# Altium project GCMPlaca.PrjPcb
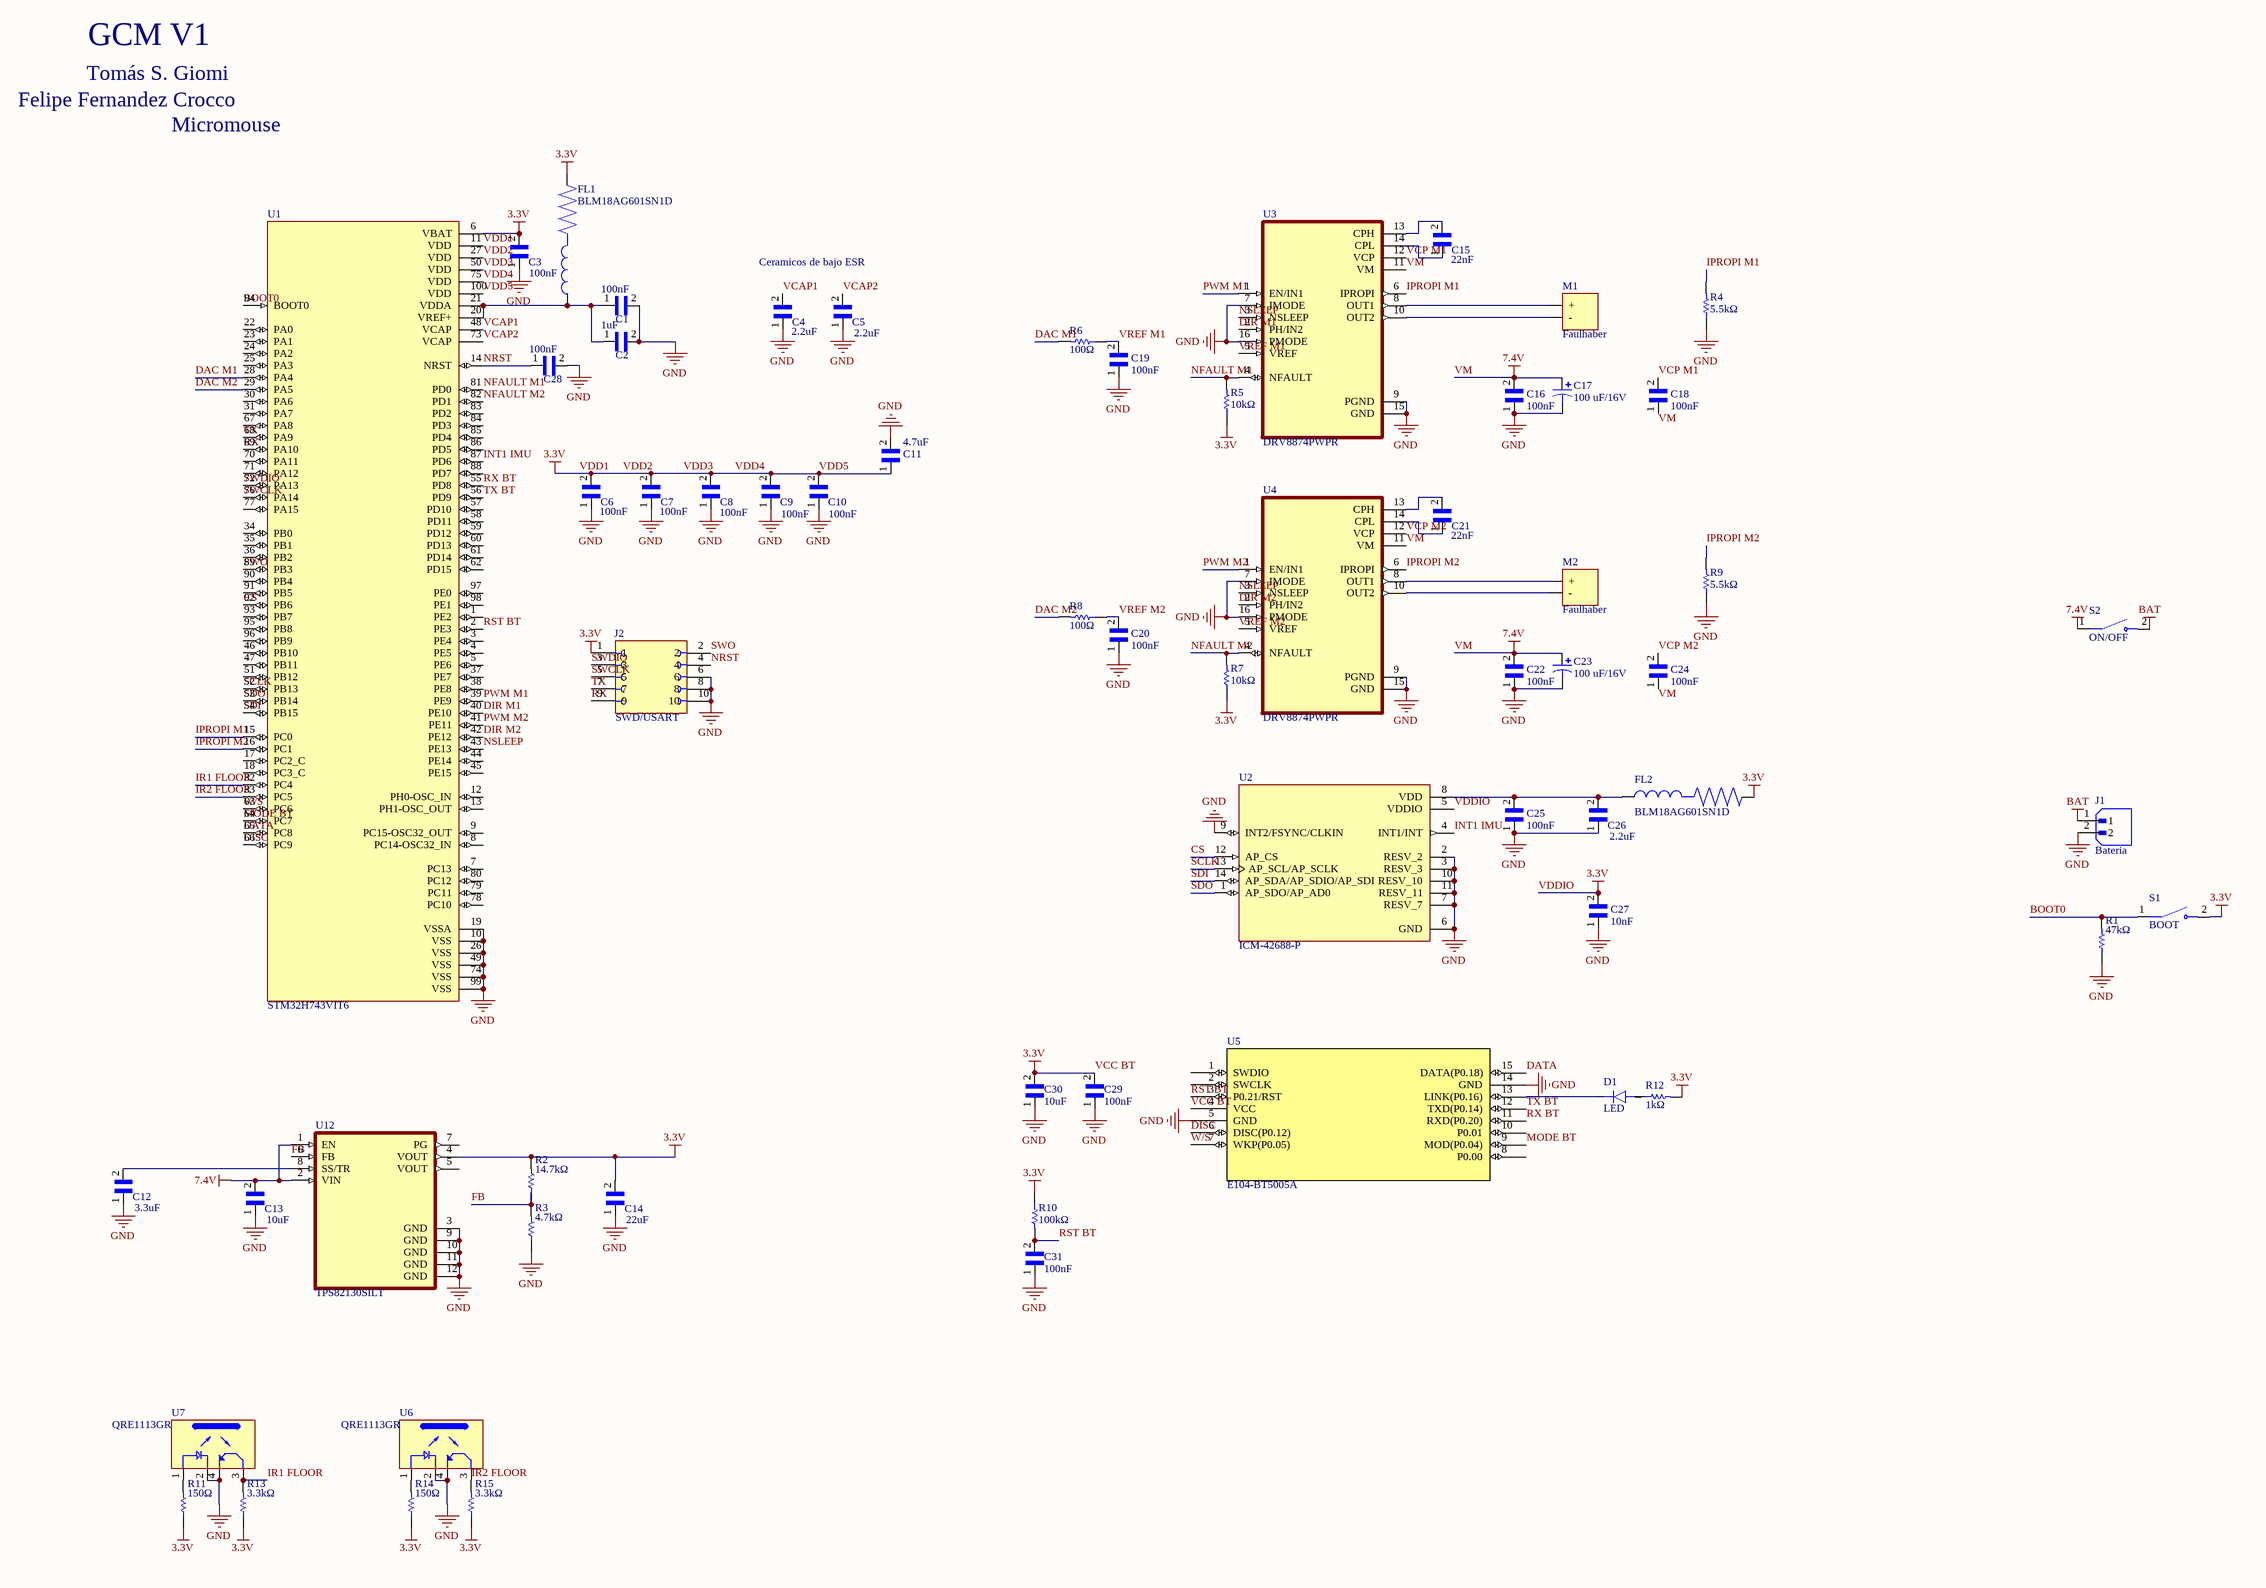
[diagram p0: GCM_SCH.SchDoc]
1 sheet, 63 parts. Net scope: global (net labels, ports and power ports of the same name join across sheets).
Board file: GCM_PCB.PcbDoc

## Sheet GCM_SCH.SchDoc
size C; SheetNumber: 1; SheetTotal: 1

### Parts
C1  100nF  [CAPACITOR TANTALIO]
C2  1uF  [CAPACITOR TANTALIO]
C3  100nF  [CAPACITOR TANTALIO]
C4  2.2uF  [CAPACITOR TANTALIO]
C5  2.2uF  [CAPACITOR TANTALIO]
C6  100nF  [CAPACITOR TANTALIO]
C7  100nF  [CAPACITOR TANTALIO]
C8  100nF  [CAPACITOR TANTALIO]
C9  100nF  [CAPACITOR TANTALIO]
C10  100nF  [CAPACITOR TANTALIO]
C11  4.7uF  [CAPACITOR TANTALIO]
C12  3.3uF  [CAPACITOR TANTALIO]
C13  10uF  [CAPACITOR TANTALIO]
C14  22uF  [CAPACITOR TANTALIO]
C15  22nF  [CAPACITOR TANTALIO]
C16  100nF  [CAPACITOR TANTALIO]
C17  100 uF/16V  [Cap El 10uF]
C18  100nF  [CAPACITOR TANTALIO]
C19  100nF  [CAPACITOR TANTALIO]
C20  100nF  [CAPACITOR TANTALIO]
C21  22nF  [CAPACITOR TANTALIO]
C22  100nF  [CAPACITOR TANTALIO]
C23  100 uF/16V  [Cap El 10uF]
C24  100nF  [CAPACITOR TANTALIO]
C25  100nF  [CAPACITOR TANTALIO]
C26  2.2uF  [CAPACITOR TANTALIO]
C27  10nF  [CAPACITOR TANTALIO]
C28  100nF  [CAPACITOR TANTALIO]
C29  100nF  [CAPACITOR TANTALIO]
C30  10uF  [CAPACITOR TANTALIO]
C31  100nF  [CAPACITOR TANTALIO]
D1  LED  [LED SMD]
FL1  BLM18AG601SN1D  [BEADC1608X95N]
FL2  BLM18AG601SN1D  [BEADC1608X95N]
J1  Bateria  [JST_B2B-XH-A]
J2  SWD/USART  [AMPHENOL_20021311-00026T4LF]
M1  Faulhaber  [MOTOR]
M2  Faulhaber  [MOTOR]
R1  47kΩ  [RESISTENCIA SMD]
R2  14.7kΩ  [RESISTENCIA SMD]
R3  4.7kΩ  [RESISTENCIA SMD]
R4  5.5kΩ  [RESISTENCIA SMD]
R5  10kΩ  [RESISTENCIA SMD]
R6  100Ω  [RESISTENCIA SMD]
R7  10kΩ  [RESISTENCIA SMD]
R8  100Ω  [RESISTENCIA SMD]
R9  5.5kΩ  [RESISTENCIA SMD]
R10  100kΩ  [RESISTENCIA SMD]
R11  150Ω  [RESISTENCIA SMD]
R12  1kΩ  [RESISTENCIA SMD]
R13  3.3kΩ  [RESISTENCIA SMD]
R14  150Ω  [RESISTENCIA SMD]
R15  3.3kΩ  [RESISTENCIA SMD]
S1  BOOT  [SW_TS09-63-25-WT-160-SMT-TR]
S2  ON/OFF  [SW_L101011ML04Q]
U1  STM32H743VIT6  [QFP50P1600X1600X160-100N]
U2  ICM-42688-P  [PQFN50P300X250X97-14N]
U3  DRV8874PWPR  [SOP65P640X120-17N]
U4  DRV8874PWPR  [SOP65P640X120-17N]
U5  E104-BT5005A  [MOD15_E104-BT5005A_BYT]
U6  QRE1113GR  [SOIC180P460X187-4N]
U7  QRE1113GR  [SOIC180P460X187-4N]
U12  TPS82130SILT  [CONV_TPS82140SILR]

### Nets
BAT: J1.1 S2.2(NO)
GND: C1.2 C2.2 C3.1 C4.1 C5.1 C6.1 C7.1 C8.1 C9.1 C10.1 C11.2 C12.1 C13.1 C14.1 C16.1 C17.2 C19.1 C20.1 C22.1 C23.2 C25.1 C26.1 C27.1 C28.2 C29.1 C30.1 C31.1 J1.2 J2.6 J2.8 J2.10 R1.1 R3.1 R4.1 R9.1 U1.10(VSS) U1.19(VSSA) U1.26(VSS) U1.49(VSS) U1.74(VSS) U1.99(VSS) U2.2(RESV_2) U2.3(RESV_3) U2.6(GND) U2.7(RESV_7) U2.9(INT2/FSYNC/CLKIN) U2.10(RESV_10) U2.11(RESV_11) U3.7(IMODE) U3.9(PGND) U3.15(GND) U3.16(PMODE) U4.7(IMODE) U4.9(PGND) U4.15(GND) U4.16(PMODE) U5.5(GND) U5.14(GND) U6.2(C) U6.4(ET) U7.2(C) U7.4(ET) U12.3(GND) U12.9(GND) U12.10(GND) U12.11(GND) U12.12(GND)
VCC BT: C3.2 C6.2 C7.2 C8.2 C9.2 C10.2 C11.1 C14.2 C27.2 C29.2 C30.2 FL1.2 FL2.2 J2.1 R2.2 R5.1 R7.1 R10.1 R11.1 R12.2 R13.1 R14.1 R15.1 S1.2 U1.6(VBAT) U1.11(VDD) U1.27(VDD) U1.50(VDD) U1.75(VDD) U1.100(VDD) U2.5(VDDIO) U5.4(VCC) U12.4(VOUT)  [also labelled 3.3V, VDD1, VDD2, VDD3, VDD4, VDD5, VDDIO]
VM: C13.2 C16.2 C17.1 C22.2 C23.1 S2.1(COM) U3.11(VM) U4.11(VM) U12.1(EN) U12.2(VIN)  [also labelled 7.4V]
BOOT0: R1.2 S1.1 U1.94(BOOT0)
CS: U1.92(PB6) U2.12(AP_CS)
DAC M1: R6.2 U1.28(PA4)
DAC M2: R8.2 U1.29(PA5)
DATA: U1.65(PC8) U5.15(DATA(P0.18))
DIR M1: U1.40(PE10) U3.2(PH/IN2)
DIR M2: U1.42(PE12) U4.2(PH/IN2)
DISC: U1.66(PC9) U5.6(DISC(P0.12))
FB: R2.1 R3.2 U12.6(FB)
INT1 IMU: U1.87(PD6) U2.4(INT1/INT)
IPROPI M1: R4.2 U1.15(PC0) U3.6(IPROPI)
IPROPI M2: R9.2 U1.16(PC1) U4.6(IPROPI)
IR1 FLOOR: R13.2 U1.32(PC4) U7.3(CT)
IR2 FLOOR: R15.2 U1.33(PC5) U6.3(CT)
MODE BT: U1.64(PC7) U5.9(MOD(P0.04))
NFAULT M1: R5.2 U1.81(PD0) U3.4(NFAULT)
NFAULT M2: R7.2 U1.82(PD1) U4.4(NFAULT)
NRST: C28.1 J2.4 U1.14(NRST)
NSLEEP: U1.43(PE13) U3.3(NSLEEP) U4.3(NSLEEP)
PWM M1: U1.39(PE9) U3.1(EN/IN1)
PWM M2: U1.41(PE11) U4.1(EN/IN1)
RST BT: C31.2 R10.2 U1.2(PE3) U5.3(P0.21/RST)
RX: J2.9 U1.69(PA10)
RX BT: U1.55(PD8) U5.11(RXD(P0.20))
SCLK: U1.52(PB13) U2.13(AP_SCL/AP_SCLK)
SDI: U1.54(PB15) U2.14(AP_SDA/AP_SDIO/AP_SDI)
SDO: U1.53(PB14) U2.1(AP_SDO/AP_AD0)
SWCLK: J2.5 U1.76(PA14)
SWDIO: J2.3 U1.72(PA13)
SWO: J2.2 U1.89(PB3)
TX: J2.7 U1.68(PA9)
TX BT: U1.56(PD9) U5.12(TXD(P0.14))
VCAP1: C4.2 U1.48(VCAP)
VCAP2: C5.2 U1.73(VCAP)
VCP M1: C18.2 U3.12(VCP)
VCP M2: C24.2 U4.12(VCP)
VREF M1: C19.2 R6.1 U3.5(VREF)
VREF M2: C20.2 R8.1 U4.5(VREF)
W/S: U1.63(PC6) U5.7(WKP(P0.05))
NetC1_1: C1.1 C2.1 FL1.1 U1.20(VREF+) U1.21(VDDA)
NetC12_2: C12.2 U12.8(SS/TR)
NetC15_1: C15.1 U3.14(CPL)
NetC15_2: C15.2 U3.13(CPH)
NetC21_1: C21.1 U4.14(CPL)
NetC21_2: C21.2 U4.13(CPH)
NetC25_2: C25.2 C26.2 FL2.1 U2.8(VDD)
NetD1_C: D1.C U5.13(LINK(P0.16))
NetM1_1: M1.1(+) U3.8(OUT1)
NetM1_2: M1.2(-) U3.10(OUT2)
NetM2_1: M2.1(+) U4.8(OUT1)
NetM2_2: M2.2(-) U4.10(OUT2)
NetR11_2: R11.2 U7.1(A)
NetR14_2: R14.2 U6.1(A)

Not connected (* = marked no-connect by the designer): C18 1; C24 1; D1 A; R12 1; U1 1(PE2) 3(PE4) 4(PE5) 5(PE6) 7(PC13) 8(PC14-OSC32_IN) 9(PC15-OSC32_OUT) 12(PH0-OSC_IN) 13(PH1-OSC_OUT) 17(PC2_C) 18(PC3_C) 22(PA0) 23(PA1) 24(PA2) 25(PA3) 30(PA6) 31(PA7) 34(PB0) 35(PB1) 36(PB2) 37(PE7) 38(PE8) 44(PE14) 45(PE15) 46(PB10) 47(PB11) 51(PB12) 57(PD10) 58(PD11) 59(PD12) 60(PD13) 61(PD14) 62(PD15) 67(PA8) 70(PA11) 71(PA12) 77(PA15) 78(PC10) 79(PC11) 80(PC12) 83(PD2) 84(PD3) 85(PD4) 86(PD5) 88(PD7) 90(PB4) 91(PB5) 93(PB7) 95(PB8) 96(PB9) 97(PE0) 98(PE1); U5 1(SWDIO) 2(SWCLK) 8(P0.00) 10(P0.01); U12 5(VOUT) 7(PG)

### Notes on the sheet
- Tomás S. Giomi
- GCM V1
- Felipe Fernandez Crocco
- Micromouse
- Ceramicos de bajo ESR
- Labels drawn without touching a wire or pin: VM

### Library data of the parts
C1-C16 C18-C22 C24-C31 = CAPACITOR TANTALIO: 0805; MP: GRM035R60J475ME15D; MF: Murata; Value: *; DigiKey-Purchase-URL: https://snapeda.com/shop?store=DigiKey&id=1181520; Package: 0603 Murata; SnapEDA_Link: https://www.snapeda.com/parts/GRM035R60J475ME15D/Murata%20Electronics%20North%20America/view-part/1181520/?ref=snap; Mouser-Purchase-URL: https://snapeda.com/shop?store=Mouser&id=1181520; Digi-Key_Part_Number: 490-13230-1-ND
C17 C23 = Cap el 10 uF
D1 = LED SMD: 0805; MP: 597-5311-402F; Package: None; Price: None; Value: *; Availability: Unavailable
FL1 FL2 = BLM18AG601SN1D: 600 Ohms @ 100 MHz 1 - Ferrite Bead 0603 (1608 Metric) 500mA 380mOhm; MF: Murata; Check_prices: https://www.snapeda.com/parts/BLM18AG601SN1D/Murata/view-part/?ref=eda; SnapEDA_Link: https://www.snapeda.com/parts/BLM18AG601SN1D/Murata/view-part/?ref=snap; Availability: In Stock; Value: *; Price: None; MP: BLM18AG601SN1D; Package: 1608 Murata; Purchase-URL: https://pricing.snapeda.com/search/part/BLM18AG601SN1D/?ref=eda
J1 = B2B-XH-A: MF: {'manufacturer': u'JST Sales America Inc.'}; Package: None; Price: None; Value: *; MP: B2B-XH-A; Availability: Unavailable
J2 = 20021311-00026T4LF: MF: Amphenol ICC; Package: None; Price: None; Value: *; MP: 20021311-00026T4LF; Availability: Unavailable
R1-R15 = RESISTENCIA: 0805; Value: 3KΩ; Published: 8-Jun-2000; LatestRevisionDate: 17-Jul-2002; LatestRevisionNote: Re-released for DXP Platform.; PackageReference: AXIAL-0.3; Publisher: Altium Limited; PackageDescription: Axial Device, Thru-Hole; 2 Leads; 0.3 in Pin Spacing
S1 = TS09-63-25-WT-160-SMT-TR: 6.1 x 3.7 mm, 2.5 mm Actuator Height, 160 gf, White, Surface Mount, SPST, Tactile Switch; MF: Same Sky; SnapEDA_Link: https://www.snapeda.com/parts/TS09-63-25-WT-160-SMT-TR/Same+Sky/view-part/?ref=snap; Package: None; Value: *; MP: TS09-63-25-WT-160-SMT-TR; Check_prices: https://www.snapeda.com/parts/TS09-63-25-WT-160-SMT-TR/Same+Sky/view-part/?ref=eda
S2 = L101011ML04Q: Switch Slide ON OFF SPST Side Slide 4A 250VAC 125VDC PC Pins Thru-Hole Bulk; MF: C&K; SnapEDA_Link: https://www.snapeda.com/parts/L101011ML04Q/C%2526K/view-part/?ref=snap; Package: None; Value: *; MP: L101011ML04Q; Check_prices: https://www.snapeda.com/parts/L101011ML04Q/C%2526K/view-part/?ref=eda
U1 = STM32H743VIT6: ARMÂ® CortexÂ®-M7 STM32H7 Microcontroller IC 32-Bit Single-Core 480MHz 2MB (2M x 8) FLASH 100-LQFP (14x14); MF: STMicroelectronics; SnapEDA_Link: https://www.snapeda.com/parts/STM32H743VIT6/STMicroelectronics/view-part/?ref=snap; Package: LQFP-100 STMicroelectronics; Value: *; MP: STM32H743VIT6; Check_prices: https://www.snapeda.com/parts/STM32H743VIT6/STMicroelectronics/view-part/?ref=eda
U2 = ICM-42688-P: Accelerometer, Gyroscope, 6 Axis Sensor Output; Package: None; MP: ICM-42688-P; Value: *; Availability: Unavailable; Price: None
U3 U4 = DRV8874PWPR: 40-V, 6-A H-bridge motor driver with integrated current sensing feedback; MF: Texas Instruments; SnapEDA_Link: https://www.snapeda.com/parts/DRV8874PWPR/Texas+Instruments/view-part/?ref=snap; Package: HTSSOP-16 Texas Instruments; Value: *; MP: DRV8874PWPR; Check_prices: https://www.snapeda.com/parts/DRV8874PWPR/Texas+Instruments/view-part/?ref=eda
U5 = E104-BT5005A: No Description Available; Manufacturer_Name: Chengdu Ebyte Elec Tech; Type: RF; Copyright: Copyright (C) 2026 Ultra Librarian. All rights reserved.; Manufacturer_Part_Number: E104-BT5005A; RefDes: RefDes
U6 U7 = QRE1113GR: Reflective Optical Sensor 0.039 (1mm) 4-SMD, Gull Wing; MF: ON Semiconductor; Package: ARUSM-313-4 ON Semiconductor; Price: None; Check_prices: https://www.snapeda.com/parts/QRE1113GR/Onsemi/view-part/?ref=eda; Value: *; SnapEDA_Link: https://www.snapeda.com/parts/QRE1113GR/Onsemi/view-part/?ref=snap; MP: QRE1113GR; Availability: In Stock; Purchase-URL: https://pricing.snapeda.com/search/part/QRE1113GR/?ref=eda
U12 = TPS82130SILT: Non-Isolated PoL Module DC DC Converter 1 Output 0.9 ~ 5V - - - 3A 3V - 17V Input; MF: Texas Instruments; SnapEDA_Link: https://www.snapeda.com/parts/TPS82130SIL/Texas+Instruments/view-part/?ref=snap; Package: None; Value: *; MP: TPS82130SIL; Check_prices: https://www.snapeda.com/parts/TPS82130SIL/Texas+Instruments/view-part/?ref=eda
M1 M2 = Faulhaber: LatestRevisionDate: 17-Jul-2002; LatestRevisionNote: Re-released for DXP Platform.; Publisher: Altium Limited